# Altium project STM32EVALBOARD.PrjPcb
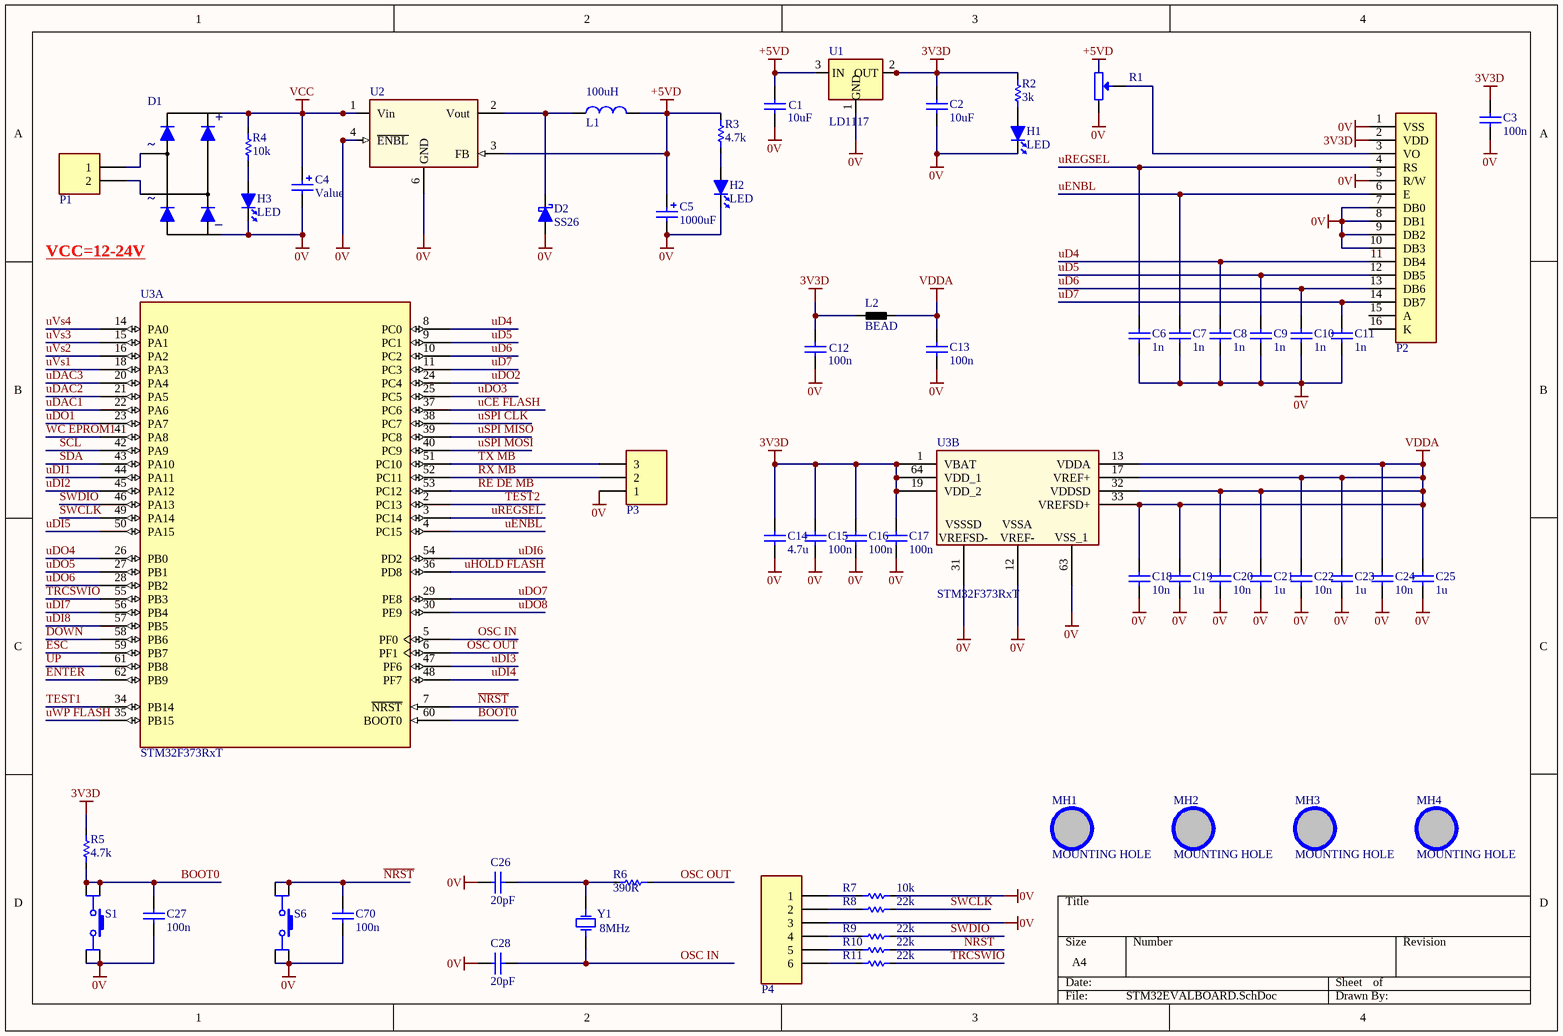
[diagram p0: STM32EVALBOARD.SchDoc]
3 sheets, 220 parts. Net scope: global (net labels, ports and power ports of the same name join across sheets).
Board file: STM32EVALBOARD.PcbDoc
Sheets:
  STM32EVALBOARD.SchDoc
  Digital.SchDoc
  Analog.SchDoc

## Sheet STM32EVALBOARD.SchDoc
size A4; SheetNumber: 1; SheetTotal: 3

### Parts
C1  10uF  [CC3216-1206L]
C2  10uF  [CC3216-1206L]
C3  100n  [CC3216-1206L]
C4  Value  [CAP AL-EL H12MM D8MM P3.5MM]
C5  1000uF  [CAP AL-EL H12MM D8MM P3.5MM]
C6  1n  [CC3216-1206L]
C7  1n  [CC3216-1206L]
C8  1n  [CC3216-1206L]
C9  1n  [CC3216-1206L]
C10  1n  [CC3216-1206L]
C11  1n  [CC3216-1206L]
C12  100n  [CC3216-1206L]
C13  100n  [CC3216-1206L]
C14  4.7u  [CC3216-1206L]
C15  100n  [CC3216-1206L]
C16  100n  [CC3216-1206L]
C17  100n  [CC3216-1206L]
C18  10n  [CC3216-1206L]
C19  1u  [CC3216-1206L]
C20  10n  [CC3216-1206L]
C21  1u  [CC3216-1206L]
C22  10n  [CC3216-1206L]
C23  1u  [CC3216-1206L]
C24  10n  [CC3216-1206L]
C25  1u  [CC3216-1206L]
C26  20pF  [CC3216-1206L]
C27  100n  [CC3216-1206L]
C28  20pF  [CC3216-1206L]
C70  100n  [CC3216-1206L]
D1  Single Phase Bridge Diode  [B10S_R2]  (value not drawn)
D2  SS26  [SMB]
H1  LED  [LED1206]
H2  LED  [LED1206]
H3  LED  [LED1206]
L1  100uH  [FPI1005]
L2  BEAD  [CL3216-1206L]
MH1  MOUNTING HOLE  [MOUNTING HOLE ROUND NONPLATED 3MM PLASTIC]  (no BOM)
MH2  MOUNTING HOLE  [MOUNTING HOLE ROUND NONPLATED 3MM PLASTIC]  (no BOM)
MH3  MOUNTING HOLE  [MOUNTING HOLE ROUND NONPLATED 3MM PLASTIC]  (no BOM)
MH4  MOUNTING HOLE  [MOUNTING HOLE ROUND NONPLATED 3MM PLASTIC]  (no BOM)
P1  CONNECTOR, 1x2, 2P  [DG128-5.0-02P-14]  (value not drawn)
P2  CONNECTOR LCD 1x16  [LCD1602]  (value not drawn)
P3  CONNECTOR, 1x3, 3P  [HDR_MALE_1X3_3P_2.54MM_180]  (value not drawn)
P4  CONNECTOR 1X6-6P  [HDR_MALE_1X6_56_2.54MM_180]  (value not drawn)
R1  Trimpot  [TRIMPOT 3386]  (value not drawn)
R2  3k  [CR3216-1206l]
R3  4.7k  [CR3216-1206l]
R4  10k  [CR3216-1206l]
R5  4.7k  [CR3216-1206l]
R6  390R  [CR3216-1206l]
R7  10k  [CR3216-1206l]
R8  22k  [CR3216-1206l]
R9  22k  [CR3216-1206l]
R10  22k  [CR3216-1206l]
R11  22k  [CR3216-1206l]
S1  SWITCH TACT  [SWITCH TACTILE SMD 6x6 4.3mm]  (value not drawn)
S6  SWITCH TACT  [SWITCH TACTILE SMD 6x6 4.3mm]  (value not drawn)
U1  LD1117  [SOT230P700X180-4N]
U2  IC-2576 V.REG.3A STEP DOWN SOP-8PP  [SOIC127P600X175-8N]  (value not drawn)
U3  STM32F373RxT  [LQFP64]  (parts A,B of 2)
Y1  8MHz  [HC49S SMD]

### Nets
0V: C1.2 C2.2 C3.2 C4.2 C5.2 C6.2 C7.2 C8.2 C9.2 C10.2 C11.2 C12.2 C13.2 C14.2 C15.2 C16.2 C17.2 C18.2 C19.2 C20.2 C21.2 C22.2 C23.2 C24.2 C25.2 C26.1 C27.2 C28.1 C70.2 D1.4(-) D2.1 H1.2(CATHODE) H2.2(CATHODE) H3.2(CATHODE) P2.1(VSS) P2.5(R/W) P2.7(DB0) P2.8(DB1) P2.9(DB2) P2.10(DB3) P3.1 P4.3 R1.3 R7.1 S1.3(B) S1.4(B) S6.3(B) S6.4(B) U1.1(GND) U2.4(~{ENBL}) U2.6(GND) U3.12(VSSA/VREF-) U3.31(VSSSD/VREFSD-) U3.63(VSS_1)
3V3D: C2.1 C3.1 C12.1 C14.1 C15.1 C16.1 C17.1 L2.2 P2.2(VDD) R2.2 R5.1 U1.2(OUT) U1.4(OUT) U3.1(VBAT) U3.19(VDD_2) U3.64(VDD_1)
+5VD: C1.1 C5.1 L1.2 R1.1 R3.2 U1.3(IN) U2.3(FB)
VCC: C4.1 D1.1(+) R4.2 U2.1(Vin)
VDDA: C13.1 C18.1 C19.1 C20.1 C21.1 C22.1 C23.1 C24.1 C25.1 L2.1 U3.13(VDDA) U3.17(VREF+) U3.32(VDDSD) U3.33(VREFSD+)
BOOT0: C27.1 R5.2 S1.1(A) S1.2(A) U3.60(BOOT0)
DOWN: U3.58(PB6)
ENTER: U3.62(PB9)
ESC: U3.59(PB7)
~{NRST}: C70.1 R10.1 S6.1(A) S6.2(A) U3.7(~{NRST})
OSC IN: C28.2 U3.5(PF0) Y1.1(OSC1)
OSC OUT: R6.1 U3.6(PF1)
~{RE} DE MB: U3.53(PC12)
RX MB: P3.2 U3.52(PC11)
SCL: U3.42(PA9)
SDA: U3.43(PA10)
SWCLK: R8.1 U3.49(PA14)
SWDIO: R9.1 U3.46(PA13)
TEST1: U3.34(PB14)
TEST2: U3.2(PC13)
TRCSWIO: R11.1 U3.55(PB3)
TX MB: P3.3 U3.51(PC10)
uCE FLASH: U3.37(PC6)
uD4: C8.1 P2.11(DB4) U3.8(PC0)
uD5: C9.1 P2.12(DB5) U3.9(PC1)
uD6: C10.1 P2.13(DB6) U3.10(PC2)
uD7: C11.1 P2.14(DB7) U3.11(PC3)
uDAC1: U3.22(PA6)
uDAC2: U3.21(PA5)
uDAC3: U3.20(PA4)
uDI1: U3.44(PA11)
uDI2: U3.45(PA12)
uDI3: U3.47(PF6)
uDI4: U3.48(PF7)
uDI5: U3.50(PA15)
uDI6: U3.54(PD2)
uDI7: U3.56(PB4)
uDI8: U3.57(PB5)
uDO1: U3.23(PA7)
uDO2: U3.24(PC4)
uDO3: U3.25(PC5)
uDO4: U3.26(PB0)
uDO5: U3.27(PB1)
uDO6: U3.28(PB2)
uDO7: U3.29(PE8)
uDO8: U3.30(PE9)
uENBL: C7.1 P2.6(E) U3.4(PC15)
uHOLD FLASH: U3.36(PD8)
UP: U3.61(PB8)
uREGSEL: C6.1 P2.4(RS) U3.3(PC14)
uSPI CLK: U3.38(PC7)
uSPI MISO: U3.39(PC8)
uSPI MOSI: U3.40(PC9)
uVs1: U3.18(PA3)
uVs2: U3.16(PA2)
uVs3: U3.15(PA1)
uVs4: U3.14(PA0)
uWP FLASH: U3.35(PB15)
~{WC} EPROM1: U3.41(PA8)
NetC26_2: C26.2 R6.2 Y1.2(OSC2)
NetD1_2: D1.2 P1.1
NetD1_3: D1.3 P1.2
NetD2_2: D2.2 L1.1 U2.2(Vout)
NetH1_1: H1.1(ANODE) R2.1
NetH2_1: H2.1(ANODE) R3.1
NetH3_1: H3.1(ANODE) R4.1
NetP2_3: P2.3(VO) R1.2
NetP4_1: P4.1 R7.2
NetP4_2: P4.2 R8.2
NetP4_4: P4.4 R9.2
NetP4_5: P4.5 R10.2
NetP4_6: P4.6 R11.2

Not connected (* = marked no-connect by the designer): P2 15(A) 16(K); U2 5(NC) 7(NC) 8(NC)

### Notes on the sheet
- (near D1) VCC=12-24V
- (in symbol DIODE DRIDGE) _
- (in symbol STM32F373RxT, part B) VSSSD / VREFSD-; VSSA / VREF-

### Library data of the parts
C1-C3 C6-C28 C70 = CAPACITOR NON-POL: Capacitor; Stock Code: *; Component Type: Capacitor
C4 C5 = CAPACITOR POL: Capacitor; Stock Code: *; Component Type: Capacitor
D1 = DIODE DRIDGE: Component Type: Diode; Stock Code: *
D2 = DIODE SCHOTTKY: SINGLE SCHOTTKY DIODE / Check the suitability of the case with the pin number; Stock Code: *; Component Type: Diode
L1 = INDUCTOR: Stock Code: *; Component Type: Inductor
L2 = BEAD: FERRITE BEAD; Stock Code: *; Component Type: Inductor
P2 = CONNECTOR LCD 1x16: LCD CONNECTOR 1x16; Component Type: Connector
R2-R11 = RESISTOR: Component Type: Resistor
S1 S6 = SWITCH TACT: TACT SWITCH; Stock Code: *; Component Type: Switch
U1 = LD1117: Linear Voltage Regulators; Component Type: IC; Stock Code: *
U2 = LM2576DP: 3A, 52kHz, Step-Down Switching Regulator
Y1 = XTAL: Stock Code: *; Component Type: XTAL
H1-H3 = LED: Stock Code: *; Component Type: Diode
P1 = CONNECTOR, 1x2, 2P: Stock Code: *; Component Type: Connector
P3 = CONNECTOR, 1x3, 3P: Component Type: Connector
P4 = CONNECTOR 1X6-6P: Stock Code: *; Component Type: Connector
R1 = Trimpot: Stock Code: *; Component Type: Resistor

## Sheet Digital.SchDoc
size A4; SheetNumber: 2; SheetTotal: 3
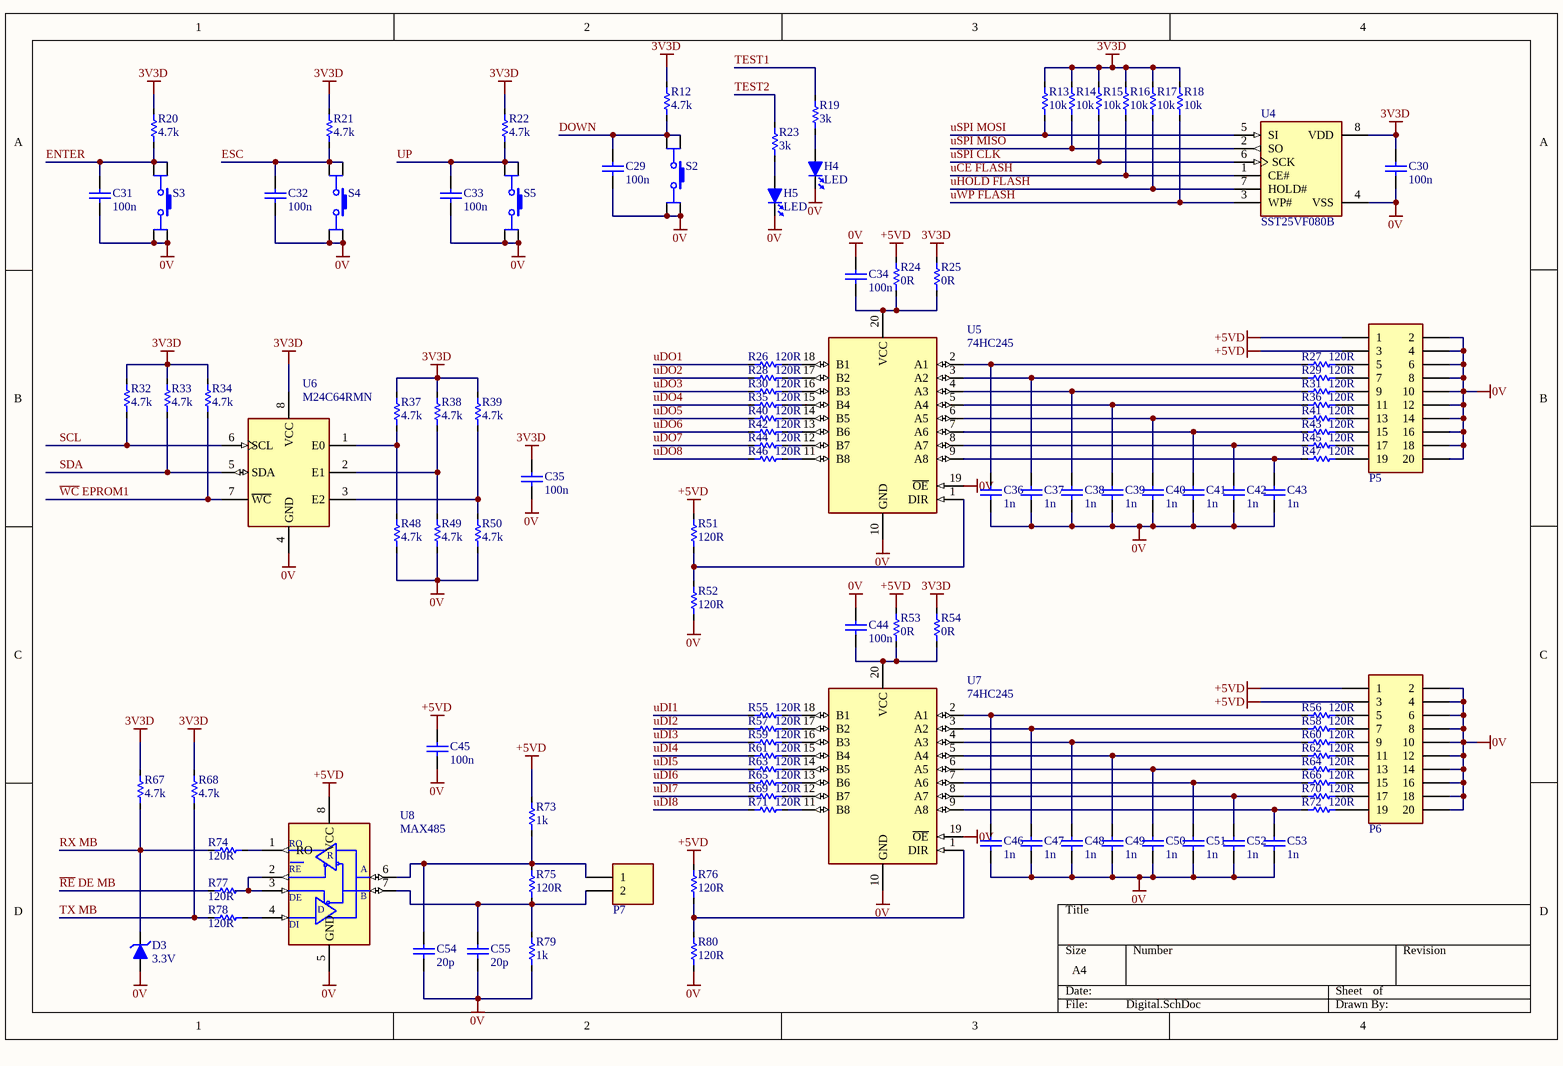
[diagram p1: Digital.SchDoc]

### Parts
C29  100n  [CC3216-1206L]
C30  100n  [CC3216-1206L]
C31  100n  [CC3216-1206L]
C32  100n  [CC3216-1206L]
C33  100n  [CC3216-1206L]
C34  100n  [CC3216-1206L]
C35  100n  [CC3216-1206L]
C36  1n  [CC3216-1206L]
C37  1n  [CC3216-1206L]
C38  1n  [CC3216-1206L]
C39  1n  [CC3216-1206L]
C40  1n  [CC3216-1206L]
C41  1n  [CC3216-1206L]
C42  1n  [CC3216-1206L]
C43  1n  [CC3216-1206L]
C44  100n  [CC3216-1206L]
C45  100n  [CC3216-1206L]
C46  1n  [CC3216-1206L]
C47  1n  [CC3216-1206L]
C48  1n  [CC3216-1206L]
C49  1n  [CC3216-1206L]
C50  1n  [CC3216-1206L]
C51  1n  [CC3216-1206L]
C52  1n  [CC3216-1206L]
C53  1n  [CC3216-1206L]
C54  20p  [CC3216-1206L]
C55  20p  [CC3216-1206L]
D3  3.3V  [SOD123]
H4  LED  [LED1206]
H5  LED  [LED1206]
P5  CONNECTOR, 2x10, 20P  [HDR_MALE_2X10_20P_2.54MM_180]  (value not drawn)
P6  CONNECTOR, 2x10, 20P  [HDR_MALE_2X10_20P_2.54MM_180]  (value not drawn)
P7  CONNECTOR, 1x2, 2P  [DS1070-2MVV6]  (value not drawn)
R12  4.7k  [CR3216-1206l]
R13  10k  [CR3216-1206l]
R14  10k  [CR3216-1206l]
R15  10k  [CR3216-1206l]
R16  10k  [CR3216-1206l]
R17  10k  [CR3216-1206l]
R18  10k  [CR3216-1206l]
R19  3k  [CR3216-1206l]
R20  4.7k  [CR3216-1206l]
R21  4.7k  [CR3216-1206l]
R22  4.7k  [CR3216-1206l]
R23  3k  [CR3216-1206l]
R24  0R  [CR3216-1206l]
R25  0R  [CR3216-1206l]
R26  120R  [CR3216-1206l]
R27  120R  [CR3216-1206l]
R28  120R  [CR3216-1206l]
R29  120R  [CR3216-1206l]
R30  120R  [CR3216-1206l]
R31  120R  [CR3216-1206l]
R32  4.7k  [CR3216-1206l]
R33  4.7k  [CR3216-1206l]
R34  4.7k  [CR3216-1206l]
R35  120R  [CR3216-1206l]
R36  120R  [CR3216-1206l]
R37  4.7k  [CR3216-1206l]
R38  4.7k  [CR3216-1206l]
R39  4.7k  [CR3216-1206l]
R40  120R  [CR3216-1206l]
R41  120R  [CR3216-1206l]
R42  120R  [CR3216-1206l]
R43  120R  [CR3216-1206l]
R44  120R  [CR3216-1206l]
R45  120R  [CR3216-1206l]
R46  120R  [CR3216-1206l]
R47  120R  [CR3216-1206l]
R48  4.7k  [CR3216-1206l]
R49  4.7k  [CR3216-1206l]
R50  4.7k  [CR3216-1206l]
R51  120R  [CR3216-1206l]
R52  120R  [CR3216-1206l]
R53  0R  [CR3216-1206l]
R54  0R  [CR3216-1206l]
R55  120R  [CR3216-1206l]
R56  120R  [CR3216-1206l]
R57  120R  [CR3216-1206l]
R58  120R  [CR3216-1206l]
R59  120R  [CR3216-1206l]
R60  120R  [CR3216-1206l]
R61  120R  [CR3216-1206l]
R62  120R  [CR3216-1206l]
R63  120R  [CR3216-1206l]
R64  120R  [CR3216-1206l]
R65  120R  [CR3216-1206l]
R66  120R  [CR3216-1206l]
R67  4.7k  [CR3216-1206l]
R68  4.7k  [CR3216-1206l]
R69  120R  [CR3216-1206l]
R70  120R  [CR3216-1206l]
R71  120R  [CR3216-1206l]
R72  120R  [CR3216-1206l]
R73  1k  [CR3216-1206l]
R74  120R  [CR3216-1206l]
R75  120R  [CR3216-1206l]
R76  120R  [CR3216-1206l]
R77  120R  [CR3216-1206l]
R78  120R  [CR3216-1206l]
R79  1k  [CR3216-1206l]
R80  120R  [CR3216-1206l]
S2  SWITCH TACT  [SWITCH TACTILE SMD 6x6 4.3mm]  (value not drawn)
S3  SWITCH TACT  [SWITCH TACTILE SMD 6x6 4.3mm]  (value not drawn)
S4  SWITCH TACT  [SWITCH TACTILE SMD 6x6 4.3mm]  (value not drawn)
S5  SWITCH TACT  [SWITCH TACTILE SMD 6x6 4.3mm]  (value not drawn)
U4  SST25VF080B  [SOIC08-S2A]
U5  74HC245  [SOIC127P1030X265-20M]
U6  M24C64RMN  [SOIC127P600X175-8N]
U7  74HC245  [SOIC127P1030X265-20M]
U8  MAX485  [SOIC127P600X175-8N]

### Nets
0V: C29.2 C30.2 C31.2 C32.2 C33.2 C34.1 C35.2 C36.2 C37.2 C38.2 C39.2 C40.2 C41.2 C42.2 C43.2 C44.1 C45.2 C46.2 C47.2 C48.2 C49.2 C50.2 C51.2 C52.2 C53.2 C54.2 C55.2 D3.1 H4.2(CATHODE) H5.2(CATHODE) P5.2 P5.4 P5.6 P5.8 P5.10 P5.12 P5.14 P5.16 P5.18 P5.20 P6.2 P6.4 P6.6 P6.8 P6.10 P6.12 P6.14 P6.16 P6.18 P6.20 R48.2 R49.2 R50.2 R52.2 R79.2 R80.2 S2.3(B) S2.4(B) S3.3(B) S3.4(B) S4.3(B) S4.4(B) S5.3(B) S5.4(B) U4.4(VSS) U5.10(GND) U5.19(~{OE}) U6.4(GND) U7.10(GND) U7.19(~{OE}) U8.5(GND)
3V3D: C30.1 C35.1 R12.1 R13.2 R14.2 R15.2 R16.2 R17.2 R18.2 R20.1 R21.1 R22.1 R25.1 R32.1 R33.1 R34.1 R37.1 R38.1 R39.1 R54.1 R67.1 R68.1 U4.8(VDD) U6.8(VCC)
+5VD: C45.1 P5.1 P5.3 P6.1 P6.3 R24.1 R51.1 R53.1 R73.1 R76.1 U8.8(VCC)
DOWN: C29.1 R12.2 S2.1(A) S2.2(A)
ENTER: C31.1 R20.2 S3.1(A) S3.2(A)
ESC: C32.1 R21.2 S4.1(A) S4.2(A)
~{RE} DE MB: R77.2
RX MB: D3.2 R67.2 R74.2
SCL: R32.2 U6.6(SCL)
SDA: R33.2 U6.5(SDA)
TEST1: R19.2
TEST2: R23.2
TX MB: R68.2 R78.2
uCE FLASH: R16.1 U4.1(CE#)
uDI1: R55.1
uDI2: R57.1
uDI3: R59.1
uDI4: R61.1
uDI5: R63.1
uDI6: R65.1
uDI7: R69.1
uDI8: R71.1
uDO1: R26.1
uDO2: R28.1
uDO3: R30.1
uDO4: R35.1
uDO5: R40.1
uDO6: R42.1
uDO7: R44.1
uDO8: R46.1
uHOLD FLASH: R17.1 U4.7(HOLD#)
UP: C33.1 R22.2 S5.1(A) S5.2(A)
uSPI CLK: R15.1 U4.6(SCK)
uSPI MISO: R14.1 U4.2(SO)
uSPI MOSI: R13.1 U4.5(SI)
uWP FLASH: R18.1 U4.3(WP#)
~{WC} EPROM1: R34.2 U6.7(~{WC})
NetC34_2: C34.2 R24.2 R25.2 U5.20(VCC)
NetC36_1: C36.1 R27.1 U5.2(A1)
NetC37_1: C37.1 R29.1 U5.3(A2)
NetC38_1: C38.1 R31.1 U5.4(A3)
NetC39_1: C39.1 R36.1 U5.5(A4)
NetC40_1: C40.1 R41.1 U5.6(A5)
NetC41_1: C41.1 R43.1 U5.7(A6)
NetC42_1: C42.1 R45.1 U5.8(A7)
NetC43_1: C43.1 R47.1 U5.9(A8)
NetC44_2: C44.2 R53.2 R54.2 U7.20(VCC)
NetC46_1: C46.1 R56.1 U7.2(A1)
NetC47_1: C47.1 R58.1 U7.3(A2)
NetC48_1: C48.1 R60.1 U7.4(A3)
NetC49_1: C49.1 R62.1 U7.5(A4)
NetC50_1: C50.1 R64.1 U7.6(A5)
NetC51_1: C51.1 R66.1 U7.7(A6)
NetC52_1: C52.1 R70.1 U7.8(A7)
NetC53_1: C53.1 R72.1 U7.9(A8)
NetC54_1: C54.1 P7.1 R73.2 R75.1 U8.6(A)
NetC55_1: C55.1 P7.2 R75.2 R79.1 U8.7(B)
NetH4_1: H4.1(ANODE) R19.1
NetH5_1: H5.1(ANODE) R23.1
NetP5_5: P5.5 R27.2
NetP5_7: P5.7 R29.2
NetP5_9: P5.9 R31.2
NetP5_11: P5.11 R36.2
NetP5_13: P5.13 R41.2
NetP5_15: P5.15 R43.2
NetP5_17: P5.17 R45.2
NetP5_19: P5.19 R47.2
NetP6_5: P6.5 R56.2
NetP6_7: P6.7 R58.2
NetP6_9: P6.9 R60.2
NetP6_11: P6.11 R62.2
NetP6_13: P6.13 R64.2
NetP6_15: P6.15 R66.2
NetP6_17: P6.17 R70.2
NetP6_19: P6.19 R72.2
NetR26_2: R26.2 U5.18(B1)
NetR28_2: R28.2 U5.17(B2)
NetR30_2: R30.2 U5.16(B3)
NetR35_2: R35.2 U5.15(B4)
NetR37_2: R37.2 R48.1 U6.1(E0)
NetR38_2: R38.2 R49.1 U6.2(E1)
NetR39_2: R39.2 R50.1 U6.3(E2)
NetR40_2: R40.2 U5.14(B5)
NetR42_2: R42.2 U5.13(B6)
NetR44_2: R44.2 U5.12(B7)
NetR46_2: R46.2 U5.11(B8)
NetR51_2: R51.2 R52.1 U5.1(DIR)
NetR55_2: R55.2 U7.18(B1)
NetR57_2: R57.2 U7.17(B2)
NetR59_2: R59.2 U7.16(B3)
NetR61_2: R61.2 U7.15(B4)
NetR63_2: R63.2 U7.14(B5)
NetR65_2: R65.2 U7.13(B6)
NetR69_2: R69.2 U7.12(B7)
NetR71_2: R71.2 U7.11(B8)
NetR74_1: R74.1 U8.1(RO)
NetR76_2: R76.2 R80.1 U7.1(DIR)
NetR77_1: R77.1 U8.2(~{RE}) U8.3(DE)
NetR78_1: R78.1 U8.4(DI)

### Notes on the sheet
- (in symbol MAX485) R; RE; D

### Library data of the parts
C29-C55 = CAPACITOR NON-POL: Capacitor; Stock Code: *; Component Type: Capacitor
D3 = DIODE ZENER: Component Type: Diode; Stock Code: *
R12-R80 = RESISTOR: Component Type: Resistor
S2-S5 = SWITCH TACT: TACT SWITCH; Stock Code: *; Component Type: Switch
U5 U7 = 74HC245: IC BUS TRANSCEIVER 8BIT 20-Pin; Stock Code: *; Component Type: IC
U8 = MAX485: ROHS-ICMAX485CSA MAXIM; Stock Code: *; Component Type: IC
H4 H5 = LED: Stock Code: *; Component Type: Diode
P5 P6 = CONNECTOR, 2x10, 20P: Component Type: Connector; Stock Code: *
P7 = CONNECTOR, 1x2, 2P: Stock Code: *; Component Type: Connector
U4 = SST25VF080B: Stock Code: *; Component Type: IC
U6 = M24C64RMN: Stock Code: *; Component Type: IC

## Sheet Analog.SchDoc
size A4; SheetNumber: 3; SheetTotal: 3
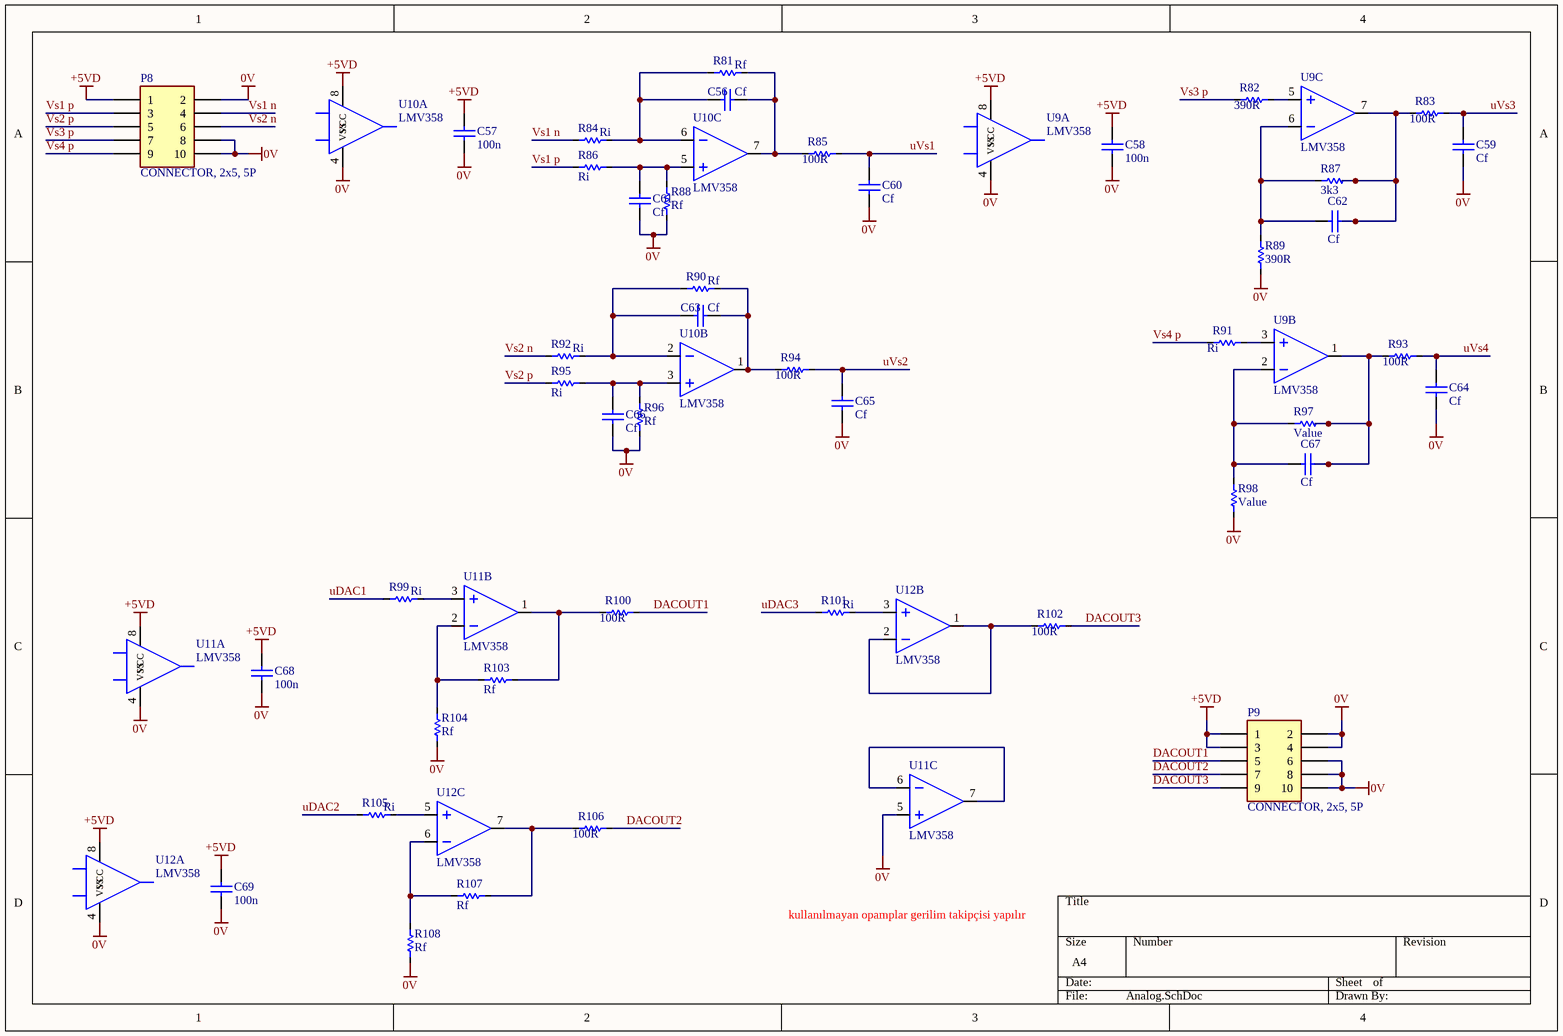
[diagram p2: Analog.SchDoc]

### Parts
C56  Cf  [CC3216-1206L]
C57  100n  [CC3216-1206L]
C58  100n  [CC3216-1206L]
C59  Cf  [CC3216-1206L]
C60  Cf  [CC3216-1206L]
C61  Cf  [CC3216-1206L]
C62  Cf  [CC3216-1206L]
C63  Cf  [CC3216-1206L]
C64  Cf  [CC3216-1206L]
C65  Cf  [CC3216-1206L]
C66  Cf  [CC3216-1206L]
C67  Cf  [CC3216-1206L]
C68  100n  [CC3216-1206L]
C69  100n  [CC3216-1206L]
P8  CONNECTOR, 2x5, 5P  [HDR_MALE_2X5_10P_2.54MM_180]
P9  CONNECTOR, 2x5, 5P  [HDR_MALE_2X5_10P_2.54MM_180]
R81  Rf  [CR3216-1206l]
R82  390R  [CR3216-1206l]
R83  100R  [CR3216-1206l]
R84  Ri  [CR3216-1206l]
R85  100R  [CR3216-1206l]
R86  Ri  [CR3216-1206l]
R87  3k3  [CR3216-1206l]
R88  Rf  [CR3216-1206l]
R89  390R  [CR3216-1206l]
R90  Rf  [CR3216-1206l]
R91  Ri  [CR3216-1206l]
R92  Ri  [CR3216-1206l]
R93  100R  [CR3216-1206l]
R94  100R  [CR3216-1206l]
R95  Ri  [CR3216-1206l]
R96  Rf  [CR3216-1206l]
R97  Value  [CR3216-1206l]
R98  Value  [CR3216-1206l]
R99  Ri  [CR3216-1206l]
R100  100R  [CR3216-1206l]
R101  Ri  [CR3216-1206l]
R102  100R  [CR3216-1206l]
R103  Rf  [CR3216-1206l]
R104  Rf  [CR3216-1206l]
R105  Ri  [CR3216-1206l]
R106  100R  [CR3216-1206l]
R107  Rf  [CR3216-1206l]
R108  Rf  [CR3216-1206l]
U9  LMV358  [SOIC127P600X175-8N]  (parts A,B,C of 3)
U10  LMV358  [SOIC127P600X175-8N]  (parts A,B,C of 3)
U11  LMV358  [SOIC127P600X175-8N]  (parts A,B,C of 3)
U12  LMV358  [SOIC127P600X175-8N]  (parts A,B,C of 3)

### Nets
0V: C57.2 C58.2 C59.1 C60.2 C61.2 C64.1 C65.2 C66.2 C68.2 C69.2 P8.2 P8.8 P8.10 P9.2 P9.4 P9.6 P9.8 P9.10 R88.1 R89.2 R96.1 R98.2 R104.1 R108.1 U9.4(VSS) U10.4(VSS) U11.4(VSS) U11.5 U12.4(VSS)
+5VD: C57.1 C58.1 C68.1 C69.1 P8.1 P9.1 P9.3 U9.8(VCC) U10.8(VCC) U11.8(VCC) U12.8(VCC)
DACOUT1: P9.5 R100.2
DACOUT2: P9.7 R106.2
DACOUT3: P9.9 R102.2
uDAC1: R99.1
uDAC2: R105.1
uDAC3: R101.1
uVs1: C60.1 R85.2
uVs2: C65.1 R94.2
uVs3: C59.2 R83.2
uVs4: C64.2 R93.2
Vs1 n: P8.4 R84.1
Vs1 p: P8.3 R86.1
Vs2 n: P8.6 R92.1
Vs2 p: P8.5 R95.1
Vs3 p: P8.7 R82.1
Vs4 p: P8.9 R91.1
NetC56_1: C56.1 R81.1 R84.2 U10.6
NetC56_2: C56.2 R81.2 R85.1 U10.7
NetC61_1: C61.1 R86.2 R88.2 U10.5
NetC62_1: C62.1 R83.1 R87.1 U9.7
NetC62_2: C62.2 R87.2 R89.1 U9.6
NetC63_1: C63.1 R90.1 R92.2 U10.2
NetC63_2: C63.2 R90.2 R94.1 U10.1
NetC66_1: C66.1 R95.2 R96.2 U10.3
NetC67_1: C67.1 R93.1 R97.1 U9.1
NetC67_2: C67.2 R97.2 R98.1 U9.2
NetR82_2: R82.2 U9.5
NetR91_2: R91.2 U9.3
NetR99_2: R99.2 U11.3
NetR100_1: R100.1 R103.2 U11.1
NetR101_2: R101.2 U12.3
NetR102_1: R102.1 U12.1 U12.2
NetR103_1: R103.1 R104.2 U11.2
NetR105_2: R105.2 U12.5
NetR106_1: R106.1 R107.2 U12.7
NetR107_1: R107.1 R108.2 U12.6
NetU11_6: U11.6 U11.7

### Notes on the sheet
- kullanılmayan opamplar gerilim takipçisi yapılır

### Library data of the parts
C56-C69 = CAPACITOR NON-POL: Capacitor; Stock Code: *; Component Type: Capacitor
P8 P9 = CONNECTOR, 2x5, 10P: Stock Code: *; Component Type: Connector
R81-R108 = RESISTOR: Component Type: Resistor
U9-U12 = OPAMP2: Dual Opamp; Stock Code: *; Component Type: IC

## Nets that join several sheets
0V: STM32EVALBOARD (54 pins), Digital (71 pins), Analog (29 pins)
3V3D: STM32EVALBOARD (16 pins), Digital (24 pins)
+5VD: STM32EVALBOARD (7 pins), Digital (11 pins), Analog (11 pins)
DOWN: STM32EVALBOARD (U3.58), Digital (C29.1 R12.2 S2.1 S2.2)
ENTER: STM32EVALBOARD (U3.62), Digital (C31.1 R20.2 S3.1 S3.2)
ESC: STM32EVALBOARD (U3.59), Digital (C32.1 R21.2 S4.1 S4.2)
~{RE} DE MB: STM32EVALBOARD (U3.53), Digital (R77.2)
RX MB: STM32EVALBOARD (P3.2 U3.52), Digital (D3.2 R67.2 R74.2)
SCL: STM32EVALBOARD (U3.42), Digital (R32.2 U6.6)
SDA: STM32EVALBOARD (U3.43), Digital (R33.2 U6.5)
TEST1: STM32EVALBOARD (U3.34), Digital (R19.2)
TEST2: STM32EVALBOARD (U3.2), Digital (R23.2)
TX MB: STM32EVALBOARD (P3.3 U3.51), Digital (R68.2 R78.2)
uCE FLASH: STM32EVALBOARD (U3.37), Digital (R16.1 U4.1)
uDAC1: STM32EVALBOARD (U3.22), Analog (R99.1)
uDAC2: STM32EVALBOARD (U3.21), Analog (R105.1)
uDAC3: STM32EVALBOARD (U3.20), Analog (R101.1)
uDI1: STM32EVALBOARD (U3.44), Digital (R55.1)
uDI2: STM32EVALBOARD (U3.45), Digital (R57.1)
uDI3: STM32EVALBOARD (U3.47), Digital (R59.1)
uDI4: STM32EVALBOARD (U3.48), Digital (R61.1)
uDI5: STM32EVALBOARD (U3.50), Digital (R63.1)
uDI6: STM32EVALBOARD (U3.54), Digital (R65.1)
uDI7: STM32EVALBOARD (U3.56), Digital (R69.1)
uDI8: STM32EVALBOARD (U3.57), Digital (R71.1)
uDO1: STM32EVALBOARD (U3.23), Digital (R26.1)
uDO2: STM32EVALBOARD (U3.24), Digital (R28.1)
uDO3: STM32EVALBOARD (U3.25), Digital (R30.1)
uDO4: STM32EVALBOARD (U3.26), Digital (R35.1)
uDO5: STM32EVALBOARD (U3.27), Digital (R40.1)
uDO6: STM32EVALBOARD (U3.28), Digital (R42.1)
uDO7: STM32EVALBOARD (U3.29), Digital (R44.1)
uDO8: STM32EVALBOARD (U3.30), Digital (R46.1)
uHOLD FLASH: STM32EVALBOARD (U3.36), Digital (R17.1 U4.7)
UP: STM32EVALBOARD (U3.61), Digital (C33.1 R22.2 S5.1 S5.2)
uSPI CLK: STM32EVALBOARD (U3.38), Digital (R15.1 U4.6)
uSPI MISO: STM32EVALBOARD (U3.39), Digital (R14.1 U4.2)
uSPI MOSI: STM32EVALBOARD (U3.40), Digital (R13.1 U4.5)
uVs1: STM32EVALBOARD (U3.18), Analog (C60.1 R85.2)
uVs2: STM32EVALBOARD (U3.16), Analog (C65.1 R94.2)
uVs3: STM32EVALBOARD (U3.15), Analog (C59.2 R83.2)
uVs4: STM32EVALBOARD (U3.14), Analog (C64.2 R93.2)
uWP FLASH: STM32EVALBOARD (U3.35), Digital (R18.1 U4.3)
~{WC} EPROM1: STM32EVALBOARD (U3.41), Digital (R34.2 U6.7)